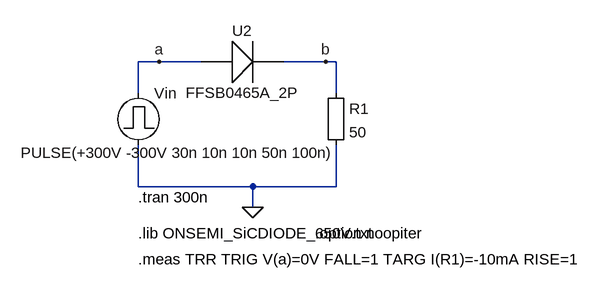
[diagram p0: schematic TRR-SiC-FFSB0465A.asc]
TRR-SiC-FFSB0465A.asc, the LTspice schematic file:
Version 4
SHEET 1 880 680
WIRE -176 80 -208 80
WIRE -112 80 -176 80
WIRE 80 80 16 80
WIRE 96 80 80 80
WIRE -208 128 -208 80
WIRE 96 128 96 80
WIRE -208 272 -208 208
WIRE -32 272 -208 272
WIRE 96 272 96 208
WIRE 96 272 -32 272
WIRE -32 304 -32 272
FLAG -32 304 0
FLAG 80 80 b
FLAG -176 80 a
SYMBOL Misc\\EuropeanResistor 80 112 R0
SYMATTR InstName R1
SYMATTR Value 50
SYMBOL pulse -208 112 R0
WINDOW 3 -181 108 Left 2
WINDOW 123 0 0 Left 0
WINDOW 39 0 0 Left 0
SYMATTR Value PULSE(+300V -300V 30n 10n 10n 50n 100n)
SYMATTR InstName Vin
SYMBOL Diode-FFSB0465A_2P -48 80 R90
WINDOW 3 32 0 VTop 2
WINDOW 0 -32 0 VBottom 2
SYMATTR InstName U2
TEXT -208 288 Left 2 !.tran 300n
TEXT -208 344 Left 2 !.lib ONSEMI_SiCDIODE_650V.txt
TEXT -208 384 Left 2 !.meas TRR TRIG V(a)=0V FALL=1 TARG I(R1)=-10mA RISE=1
TEXT 64 344 Left 2 !.option noopiter

The netlist it stands for:
* TRR-SiC-FFSB0465A.asc
R1 b 0 50
Vin a 0 PULSE(+300V -300V 30n 10n 10n 50n 100n)
XU2 a b FFSB0465A_2P  ; pins A C
.tran 300n
.lib ONSEMI_SiCDIODE_650V.txt
.meas TRR TRIG V(a)=0V FALL=1 TARG I(R1)=-10mA RISE=1
.option noopiter
.backanno
.end